# Altium schematic sheet 07_NINA-WIFI.SchDoc: GAP9Shield
size A3; DrawnBy: Hanna Müller and Victor Kartsch; Organization: Integrated Systems Laboratory; DocumentNumber: 7; Revision: v1.0; SheetNumber: 7; SheetTotal: 9
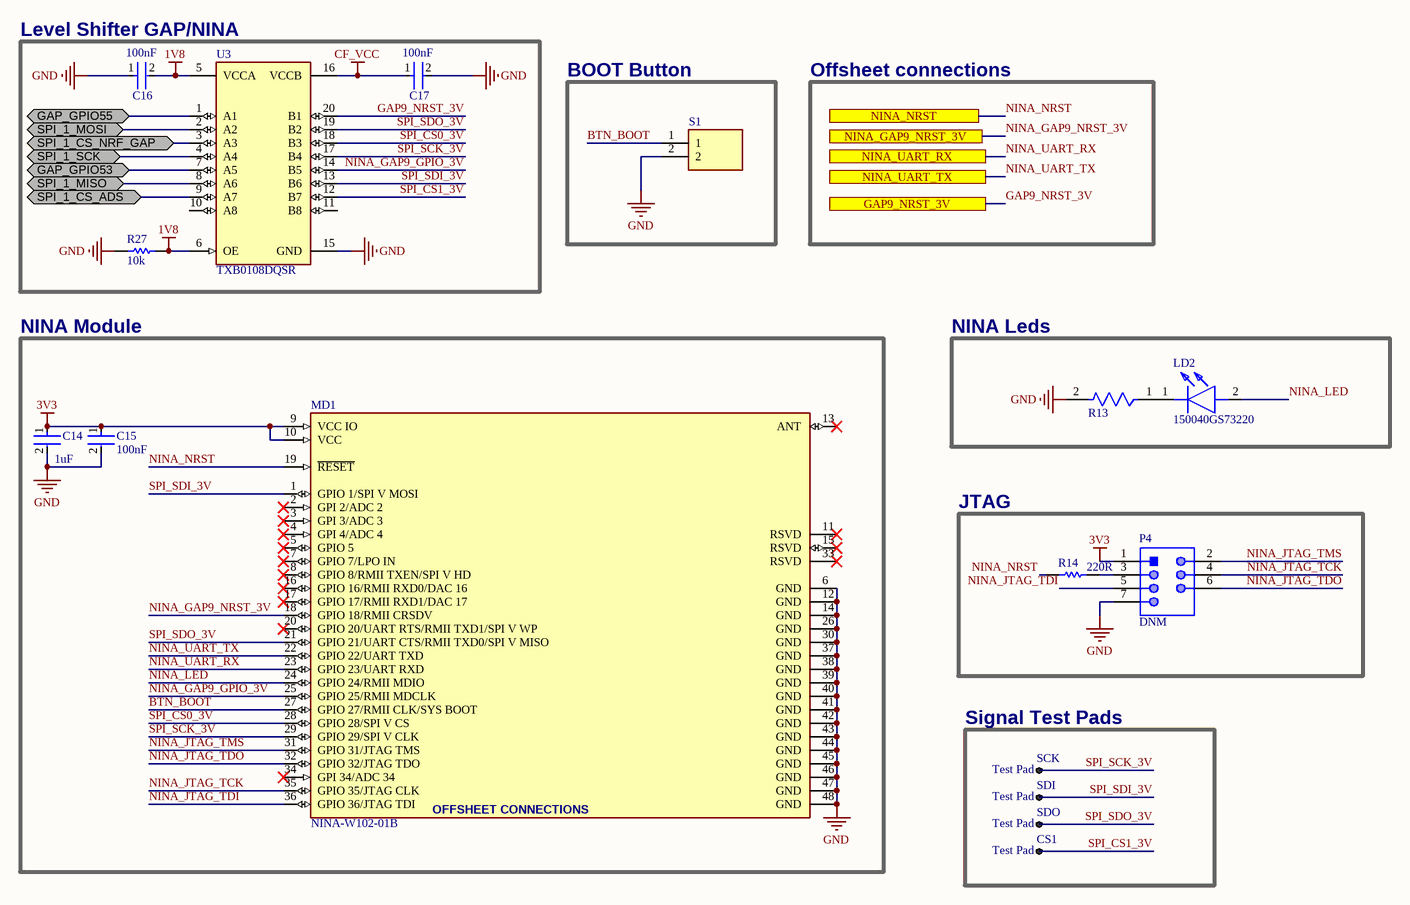
[diagram p0: 07_NINA-WIFI.SchDoc]

## Parts
C14  value 1uF  [FP-GRM155-0_05-IPC_B]  (hidden comment: GRM155R61E105MA12D)
C15  value 100nF  [FP-C1005-050-0_05-MFG]  (hidden comment: C1005X5R1E104K050BC)
C16  value 100nF  [FP-C1005-050-0_05-MFG]  (hidden comment: C1005X5R1E104K050BC)
C17  value 100nF  [FP-C1005-050-0_05-MFG]  (hidden comment: C1005X5R1E104K050BC)
CS1  Test Pad  [Pad-1.5mm]  (no BOM)
LD2  150040GS73220  [150040GS73220]
MD1  NINA-W102-01B  [FP-NINA-W102-00B-00-MFG]
P4  DNM  [JTAG_MINI]
R13  RC0201JR-070RL  [FP-RC_L0201-MFG]  (value not drawn)
R14  value 220R  [RESC0603X28X15ML05T05]  (hidden comment: CRCW0201220RFKED)
R27  value 10k  [RESC0603X28X15LL05T05]  (hidden comment: CRCW020110K0FNED)
S1  TS19-32-06-BK-70-1-SMT-TR-67  [TS193206BK701SMTTR67]  (value not drawn)
SCK  Test Pad  [Pad-1.5mm]  (no BOM)
SDI  Test Pad  [Pad-1.5mm]  (no BOM)
SDO  Test Pad  [Pad-1.5mm]  (no BOM)
U3  TXB0108DQSR  [FP-DQS0020A-MFG]

## Blocks framed on the sheet
Level Shifter GAP/NINA: C16 C17 R27 U3
BOOT Button: S1
NINA Module: C14 C15 MD1
NINA Leds: LD2 R13
JTAG: P4 R14
Signal Test Pads: CS1 SCK SDI SDO

## Ports
GAP9_NRST_3V, GAP_GPIO53 (bidir), GAP_GPIO55 (bidir), NINA_GAP9_NRST_3V, NINA_NRST, NINA_UART_RX, NINA_UART_TX, SPI_1_CS_ADS (bidir), SPI_1_CS_NRF_GAP (bidir), SPI_1_MISO (bidir), SPI_1_MOSI (bidir), SPI_1_SCK (bidir)

## Nets
1V8: C16.2 R27.1 U3.5(VCCA) U3.6(OE)
3V3: C14.1 C15.1 MD1.9(VCC_IO) MD1.10(VCC) P4.1
CF_VCC: C17.1 U3.16(VCCB)
GND: C14.2 C15.2 C16.1 C17.2 MD1.6(GND) MD1.12(GND) MD1.14(GND) MD1.26(GND) MD1.30(GND) MD1.37(GND) MD1.38(GND) MD1.39(GND) MD1.40(GND) MD1.41(GND) MD1.42(GND) MD1.43(GND) MD1.44(GND) MD1.45(GND) MD1.46(GND) MD1.47(GND) MD1.48(GND) P4.7 R13.2 R27.2 S1.2 U3.15(GND)
BTN_BOOT: MD1.27(GPIO_27/RMII_CLK/SYS_BOOT) S1.1
GAP9_NRST_3V: U3.20(B1) ; port GAP9_NRST_3V
GAP_GPIO53: U3.7(A5) ; port GAP_GPIO53
GAP_GPIO55: U3.1(A1) ; port GAP_GPIO55
NINA_GAP9_GPIO_3V: MD1.25(GPIO_25/RMII_MDCLK) U3.14(B5)
NINA_GAP9_NRST_3V: MD1.18(GPIO_18/RMII_CRSDV) ; port NINA_GAP9_NRST_3V
NINA_JTAG_TCK: MD1.35(GPIO_35/JTAG_CLK) P4.4
NINA_JTAG_TDI: MD1.36(GPIO_36/JTAG_TDI) P4.5
NINA_JTAG_TDO: MD1.32(GPIO_32/JTAG_TDO) P4.6
NINA_JTAG_TMS: MD1.31(GPIO_31/JTAG_TMS) P4.2
NINA_LED: LD2.2(A) MD1.24(GPIO_24/RMII_MDIO)
NINA_NRST: MD1.19(~{RESET}) R14.2 ; port NINA_NRST
NINA_UART_RX: MD1.23(GPIO_23/UART_RXD) ; port NINA_UART_RX
NINA_UART_TX: MD1.22(GPIO_22/UART_TXD) ; port NINA_UART_TX
SPI_1_CS_ADS: U3.9(A7) ; port SPI_1_CS_ADS
SPI_1_CS_NRF_GAP: U3.3(A3) ; port SPI_1_CS_NRF_GAP
SPI_1_MISO: U3.8(A6) ; port SPI_1_MISO
SPI_1_MOSI: U3.2(A2) ; port SPI_1_MOSI
SPI_1_SCK: U3.4(A4) ; port SPI_1_SCK
SPI_CS0_3V: MD1.28(GPIO_28/SPI_V_CS) U3.18(B3)
SPI_CS1_3V: CS1.1 U3.12(B7)
SPI_SCK_3V: MD1.29(GPIO_29/SPI_V_CLK) SCK.1 U3.17(B4)
SPI_SDI_3V: MD1.1(GPIO_1/SPI_V_MOSI) SDI.1 U3.13(B6)
SPI_SDO_3V: MD1.21(GPIO_21/UART_CTS/RMII_TXD0/SPI_V_MISO) SDO.1 U3.19(B2)
NetLD2_1: LD2.1(K) R13.1
NetP4_3: P4.3 R14.1

Not connected (* = marked no-connect by the designer): MD1 2(GPI_2/ADC_2)* 3(GPI_3/ADC_3)* 4(GPI_4/ADC_4)* 5(GPIO_5)* 7(GPIO_7/LPO_IN)* 8(GPIO_8/RMII_TXEN/SPI_V_HD)* 11(RSVD)* 13(ANT)* 15(RSVD)* 16(GPIO_16/RMII_RXD0/DAC_16)* 17(GPIO_17/RMII_RXD1/DAC_17)* 20(GPIO_20/UART_RTS/RMII_TXD1/SPI_V_WP)* 33(RSVD)* 34(GPI_34/ADC_34)*; U3 10(A8) 11(B8)

## Notes on the sheet
- Offsheet connections
- (near MD1) OFFSHEET CONNECTIONS
- 1
- 2
- 3
- 4
- 5
- 6
- 7
- 8
- A
- B
- C
- D
- Project:
- Date:
- Drawing number:
- Rev:
- Format:
- A3
- Drawn by:
- Laboratory:
- Page
- Sheet:
- of
- File:

## Library data of the parts
C14 = CMP-06035-012395-1: Chip Multilayer Ceramic Capacitors for General Purpose, 0402, 1.0uF, X5R, 15%, 20%, 25V; Weight: 0.000212oz; Dielectric: X5R; Case Code (Metric): 1005; Thickness: 0.022inch; Min Operating Temperature: -55°C; Voltage Rating (DC): 25V; Lead Free: Lead Free; Voltage Rating: 25V; Max Operating Temperature: 85°C; Case/Package: 0402; Packaging: Tape and Reel; Package Quantity: 10000; Termination: SMD/SMT; Height: 0.5mm; Width: 0.5mm; Mount: Surface Mount; Case Code (Imperial): 0402; Tolerance: 20%; Capacitance: 1uF; Length: 0.039inch
C15-C17 = CMP-2000-06000-2: Multilayer Ceramic Capacitors 100nF ±10% 25V X5R SMD 0402; Case Code (Imperial): 0402; Termination: Wraparound; Series: C; Depth: 0.5mm; Voltage Rating (DC): 25V; Contact Plating: Tin; Case Code (Metric): 1005; Dielectric: X5R; Case/Package: 0402; Voltage Rating: 25V; Packaging: Tape and Reel; Thickness: 0.022inch; Dielectric Material: Ceramic; Height: 0.5mm; Weight: 2.3E-05oz; RoHS Compliant: Yes; Width: 0.02inch; Capacitance: 100nF; Tolerance: 10%; Mount: Surface Mount; Package Quantity: 1; Max Operating Temperature: 85°C; Construction: Flat; Min Operating Temperature: -55°C; REACH SVHC: No SVHC; Resistor Type: Ceramic; Length: 1mm; Lead Free: Lead Free; Voltage: 25V
CS1 SCK SDI SDO = CMP-01283-1: 1mm SMT Test Pad; Mounting Technology: SMT
LD2 = 150040GS73220: LED; Manufacturer_Name: Wurth Elektronik; Datasheet Link: https://www.mouser.com/datasheet/2/445/150040GS73220-1714597.pdf; Height: 0.35mm; Manufacturer_Part_Number: 150040GS73220; Mouser Part Number: 710-150040GS73220; Mouser Price/Stock: https://www.mouser.co.uk/ProductDetail/Wurth-Elektronik/150040GS73220?qs=u16ybLDytRZ9vktXLUK1Kg%3D%3D
MD1 = CMP-207130-000007-1: STAND-ALONE MULTIRADIO MODULES; Manufacturer Part Number: NINA-W102-00B-00; Manufacturer: U-Blox; Max Supply Voltage: 3.6V; Number Of Adc Channels: 17; Receiving Current: 100-140mA; Nominal Supply Current: 30-190mA; Data Rate: 100Mbits/s; Max Frequency: 2.5GHz; Sensitivity: -96dBm; Min Supply Voltage: 3V; Interface: I2C,SPI,UART,CAN,Ethernet,I2S,Other; Bandwidth: 20MHz; Transmitting Current: 225-320mA; Number Of Gpio: 20; Device Class L3: Transceivers; Octopart: https://octopart.com/nina-w102-00b-00-u-blox-103157672; Automotive: No; Category: UNK; Temperature: -40°C to +85°C; Lead Free: Yes; Device Class L1: Integrated Circuits (ICs); ComponentLink2Description: Datasheet; Temperature Range Low: -40°C; Package: 0; Temperature Range High: +85°C; Digikey Description: STAND-ALONE MULTIRADIO MODULES; Device Class L2: RF Semiconductors and Devices; ComponentLink2URL: https://www.u-blox.com/sites/default/files/NINA-W10_DataSheet_%28UBX-17065507%29.pdf; RoHS: TRUE; Height: 4.2mm
P4 = JTAG_MINI: 2x10 Pin 50mil Header; PN: 20021111-00010T4LF; Supplier 1: Digi-Key; Supplier Part Number 1: 732-5374-ND
R13 = CMP-03412-023265-1: RES SMD 0 OHM JUMPER 1/20W 0201; Manufacturer: Yageo; Power Rating: 50mW; Value: 0Ω; Temperature Coefficient: 200ppm/°C; Voltage Rating: 25V; Tolerance: 5%; Octopart: https://octopart.com/rc0201jr-070rl-yageo-43171986; ComponentLink2URL: http://www.yageo.com/documents/recent/PYu-RC_Group_51_RoHS_L_10.pdf; Device Class L2: Resistors; Series: RC_L; Ipc Land Pattern Name: RESC6030X23; Temperature: -55°C to +125°C; Mouser Description: Thick Film Resistors ZERO OHM JUMPER; Footprint Url: http://www.yageo.com/exep/pages/download/literatures/PYu-R_Mount_10.pdf; RoHS: TRUE; Package: RC_L0201; Device Class L3: Chip SMD Resistors; Temperature Range Low: -55°C; Composition: Thick Film; ComponentLink2Description: Datasheet; Height: 0.26mm; Device Class L1: Passive Components; Category: Res; Resistance: 0Ω; Manufacturer Part Number: RC0201JR-070RL; Temperature Range High: +125°C; Automotive: No; Lead Free: Yes; Digikey Description: RES SMD 0 OHM JUMPER 1/20W 0201
R14 = CMP-2004-00982-1: Manufacturer: Vishay Dale; Part Number: CRCW0201220RFKED
R27 = CMP-2004-00016-1: Manufacturer: Vishay Dale; Part Number: CRCW020110K0FNED
S1 = TS19-32-06-BK-70-1-SMT-TR-67: Switch; Manufacturer_Name: CUI Devices; Datasheet Link: https://www.cuidevices.com/product/resource/ts19.pdf; Height: 0.65mm; Manufacturer_Part_Number: TS19-32-06-BK-70-1-SMT-TR-67; Mouser Part Number: 179-TS193206BK701SM; Mouser Price/Stock: https://www.mouser.co.uk/ProductDetail/CUI-Devices/TS19-32-06-BK-70-1-SMT-TR-67?qs=tlsG%2FOw5FFj0aJkgA5InKg%3D%3D
U3 = CMP-04899-000009-1: IC TRNSLTR BIDIRECTIONAL 20USON; Manufacturer: Texas Instruments; Nominal Supply Current: 0.05-3.5uA; Propagation Delay: 4ns; Max Supply Voltage: 5.5V; V A Min: 1.2V; Max Junction Temp: +150°C; Logic Function Desc: Non-Inverting; Number Of Inputs: 1; V A Max: 3.6V; Number Of Circuits: 8; V B Min: 1.65V; Standoff Height: 0mm; Data Rate: 100Mbits/s; Automotive: No; Mouser Description: Translation - Voltage Levels 8B Bidir Vltg-Level Translator; Category: IC; Temperature Range Low: -40°C; Package: DQS0020A; Manufacturer Part Number: TXB0108DQSR; ComponentLink2Description: Datasheet; Device Class L3: Voltage Level Shifters; Device Class L2: Logic ICs; Temperature Range High: +85°C; Digikey Description: IC TRNSLTR BIDIRECTIONAL 20USON; Octopart: https://octopart.com/txb0108dqsr-texas+instruments-18562890; RoHS: TRUE; Ambient Temperature Range High: +85°C; Lead Free: Yes; V B Max: 5.5V; ComponentLink2URL: https://www.ti.com/lit/ds/symlink/txb0108.pdf; Height: 0.55mm; Ambient Temperature Range Low: -40°C; Temperature: -40°C to +85°C; Number Of Outputs: 1; Min Supply Voltage: 1.2V; Device Class L1: Integrated Circuits (ICs)